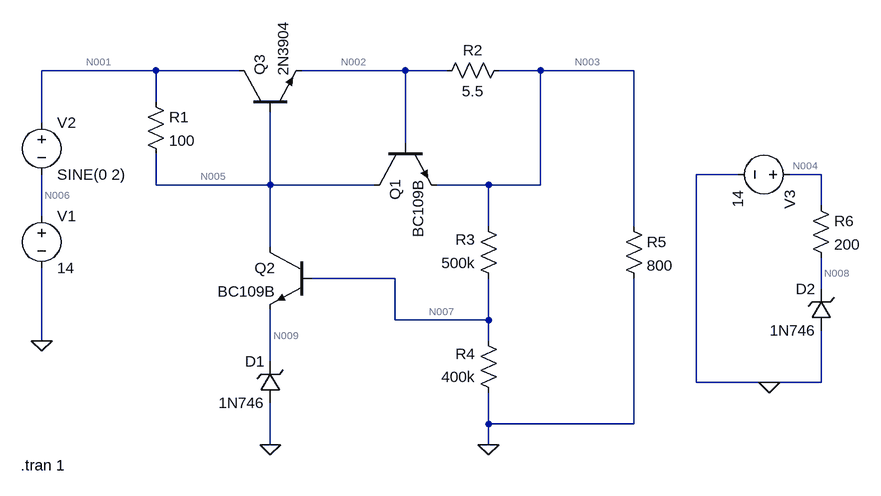
[diagram p0: schematic Linear Power Supply.asc]
Linear Power Supply.asc, the LTspice schematic file:
Version 4
SHEET 1 3476 680
WIRE -112 -32 -288 -32
WIRE 16 -32 -112 -32
WIRE 272 -32 112 -32
WIRE 336 -32 272 -32
WIRE 480 -32 416 -32
WIRE 624 -32 480 -32
WIRE -112 16 -112 -32
WIRE -288 48 -288 -32
WIRE 272 80 272 -32
WIRE 784 128 720 128
WIRE 912 128 864 128
WIRE -112 144 -112 96
WIRE 64 144 64 32
WIRE 64 144 -112 144
WIRE 224 144 64 144
WIRE 400 144 320 144
WIRE 480 144 480 -32
WIRE 480 144 400 144
WIRE 912 176 912 128
WIRE -288 192 -288 128
WIRE 400 208 400 144
WIRE 624 208 624 -32
WIRE 64 240 64 144
WIRE 256 288 128 288
WIRE 912 304 912 256
WIRE 256 352 256 288
WIRE 400 352 400 288
WIRE 400 352 256 352
WIRE -288 384 -288 272
WIRE 400 384 400 352
WIRE 64 416 64 336
WIRE 720 448 720 128
WIRE 832 448 720 448
WIRE 912 448 912 368
WIRE 912 448 832 448
WIRE 400 512 400 464
WIRE 624 512 624 288
WIRE 624 512 400 512
WIRE 64 544 64 480
WIRE 400 544 400 512
FLAG -288 384 0
FLAG 400 544 0
FLAG 64 544 0
FLAG 832 448 0
SYMBOL npn 224 80 M90
SYMATTR InstName Q1
SYMATTR Value BC109B
SYMBOL npn 128 240 M0
SYMATTR InstName Q2
SYMATTR Value BC109B
SYMBOL npn 16 32 R270
SYMATTR InstName Q3
SYMATTR Value 2N3904
SYMBOL res -128 0 R0
SYMATTR InstName R1
SYMATTR Value 100
SYMBOL res 432 -48 R90
WINDOW 0 0 56 VBottom 2
WINDOW 3 32 56 VTop 2
SYMATTR InstName R2
SYMATTR Value 5.5
SYMBOL res 416 304 R180
WINDOW 0 36 76 Left 2
WINDOW 3 36 40 Left 2
SYMATTR InstName R3
SYMATTR Value 500k
SYMBOL res 416 480 R180
WINDOW 0 36 76 Left 2
WINDOW 3 36 40 Left 2
SYMATTR InstName R4
SYMATTR Value 400k
SYMBOL res 608 192 R0
SYMATTR InstName R5
SYMATTR Value 800
SYMBOL voltage -288 176 R0
WINDOW 123 0 0 Left 0
WINDOW 39 0 0 Left 0
SYMATTR InstName V1
SYMATTR Value 14
SYMBOL voltage -288 32 R0
WINDOW 123 0 0 Left 0
WINDOW 39 0 0 Left 0
SYMATTR InstName V2
SYMATTR Value SINE(0 2)
SYMBOL zener 80 480 R180
WINDOW 0 24 64 Left 2
WINDOW 3 24 0 Left 2
SYMATTR InstName D1
SYMATTR Value 1N746
SYMATTR Description Diode
SYMATTR Type diode
SYMBOL zener 928 368 R180
WINDOW 0 24 64 Left 2
WINDOW 3 24 0 Left 2
SYMATTR InstName D2
SYMATTR Value 1N746
SYMATTR Description Diode
SYMATTR Type diode
SYMBOL voltage 880 128 R90
WINDOW 123 0 0 Left 0
WINDOW 39 0 0 Left 0
SYMATTR InstName V3
SYMATTR Value 14
SYMBOL res 896 160 R0
SYMATTR InstName R6
SYMATTR Value 200
TEXT -320 576 Left 2 !.tran 1

The netlist it stands for:
* Linear Power Supply.asc
Q1 N005 N002 N003 0 BC109B
Q2 N005 N007 N009 0 BC109B
Q3 N001 N005 N002 0 2N3904
R1 N001 N005 100
R2 N003 N002 5.5
R3 N007 N003 500k
R4 0 N007 400k
R5 N003 0 800
V1 N006 0 14
V2 N001 N006 SINE(0 2)
D1 0 N009 1N746
D2 0 N008 1N746
V3 N004 0 14
R6 N004 N008 200
.model D D
.lib standard.dio
.model NPN NPN
.model PNP PNP
.lib standard.bjt
.tran 1
.backanno
.end

* Results of the author's LTspice run, read from the files saved beside the schematic
* Operating Point, zero values left out:
*   V(n005) = 13.64 V
*   V(n002) = 12.91 V
*   V(n003) = 12.83 V
*   V(n007) = 3.382 V
*   V(n009) = 2.69 V
*   V(n001) = 14 V
*   V(n006) = 14 V
*   V(n008) = 3.741 V
*   V(n004) = 14 V
*   Ic(Q3) = 16 mA
*   Ib(Q3) = 55.25 µA
*   Ie(Q3) = -16.05 mA
*   Ic(Q2) = 3.499 mA
*   Ib(Q2) = 10.43 µA
*   Ie(Q2) = -3.509 mA
*   Ic(Q1) = 193.9 pA
*   Ib(Q1) = -193 pA
*   I(D2) = -51.29 mA
*   I(D1) = -3.509 mA
*   I(R6) = 51.29 mA
*   I(R5) = 16.03 mA
*   I(R4) = -8.456 µA
*   I(R3) = -18.89 µA
*   I(R2) = -16.05 mA
*   I(R1) = 3.554 mA
*   I(V3) = -51.29 mA
*   I(V2) = -19.55 mA
*   I(V1) = -19.55 mA